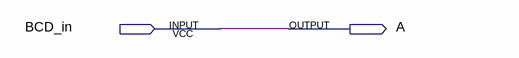
[diagram p0: schematic sheet]
// Quartus schematic DECOD_BCD_A.bdf as structural Verilog: 0 symbols, 2 pins
module DECOD_BCD_A (
  input  BCD_in,
  output A
);


  assign A = BCD_in;
endmodule
